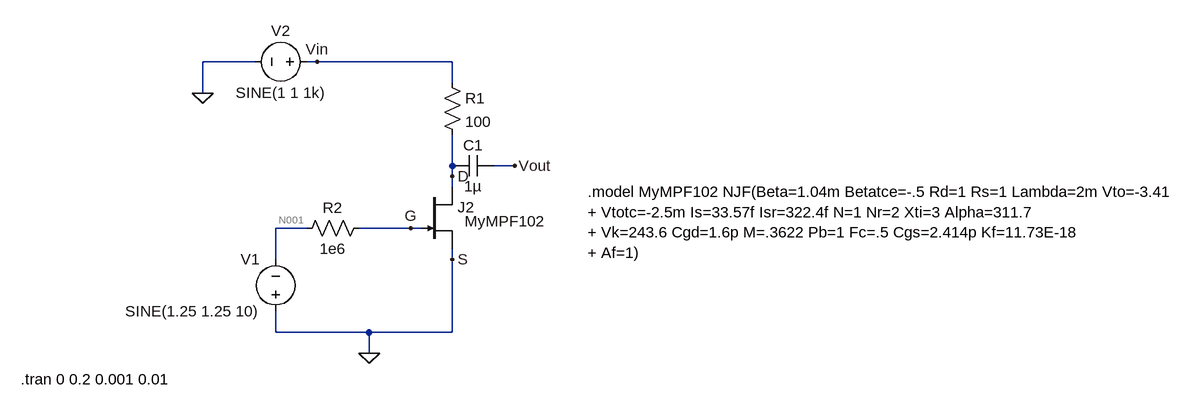
[diagram p0: schematic jfet_with_variable_gate_voltage.asc]
jfet_with_variable_gate_voltage.asc, the LTspice schematic file:
Version 4
SHEET 1 1424 680
WIRE -192 -96 -272 -96
WIRE -96 -96 -112 -96
WIRE 112 -96 -96 -96
WIRE 112 -64 112 -96
WIRE -272 -48 -272 -96
WIRE 112 64 112 16
WIRE 208 64 176 64
WIRE 112 80 112 64
WIRE 112 96 112 80
WIRE -112 160 -160 160
WIRE 48 160 -32 160
WIRE 64 160 48 160
WIRE -160 208 -160 160
WIRE 112 208 112 192
WIRE -160 320 -160 288
WIRE -16 320 -160 320
WIRE 112 320 112 208
WIRE 112 320 -16 320
WIRE -16 352 -16 320
FLAG 112 80 D
FLAG -16 352 0
FLAG -272 -48 0
FLAG 112 208 S
FLAG 48 160 G
FLAG -96 -96 Vin
FLAG 208 64 Vout
SYMBOL njf 64 96 R0
WINDOW 3 67 53 Left 2
SYMATTR Value MyMPF102
SYMATTR InstName J2
SYMBOL voltage -96 -96 R90
WINDOW 0 -32 56 VBottom 2
WINDOW 3 32 56 VTop 2
WINDOW 123 0 0 Left 0
WINDOW 39 0 0 Left 0
SYMATTR InstName V2
SYMATTR Value SINE(1 1 1k)
SYMBOL voltage -160 304 R180
WINDOW 0 24 96 Left 2
WINDOW 3 24 16 Left 2
WINDOW 123 0 0 Left 0
WINDOW 39 0 0 Left 0
SYMATTR InstName V1
SYMATTR Value SINE(1.25 1.25 10)
SYMBOL res 96 -80 R0
SYMATTR InstName R1
SYMATTR Value 100
SYMBOL cap 176 48 R90
WINDOW 0 0 32 VBottom 2
WINDOW 3 32 32 VTop 2
SYMATTR InstName C1
SYMATTR Value 1µ
SYMBOL res -16 144 R90
WINDOW 0 0 56 VBottom 2
WINDOW 3 32 56 VTop 2
SYMATTR InstName R2
SYMATTR Value 1e6
TEXT 320 104 Left 2 !.model MyMPF102 NJF(Beta=1.04m Betatce=-.5 Rd=1 Rs=1 Lambda=2m Vto=-3.41\n+ Vtotc=-2.5m Is=33.57f Isr=322.4f N=1 Nr=2 Xti=3 Alpha=311.7\n+ Vk=243.6 Cgd=1.6p M=.3622 Pb=1 Fc=.5 Cgs=2.414p Kf=11.73E-18\n+ Af=1)
TEXT -552 392 Left 2 !.tran 0 0.2 0.001 0.01

The netlist it stands for:
* jfet_with_variable_gate_voltage.asc
J2 D G 0 MyMPF102
V2 Vin 0 SINE(1 1 1k)
V1 0 N001 SINE(1.25 1.25 10)
R1 Vin D 100
C1 Vout D 1µ
R2 G N001 1e6
.model NJF NJF
.model PJF PJF
.lib standard.jft
.model MyMPF102 NJF(Beta=1.04m Betatce=-.5 Rd=1 Rs=1 Lambda=2m Vto=-3.41
+ Vtotc=-2.5m Is=33.57f Isr=322.4f N=1 Nr=2 Xti=3 Alpha=311.7
+ Vk=243.6 Cgd=1.6p M=.3622 Pb=1 Fc=.5 Cgs=2.414p Kf=11.73E-18
+ Af=1)
.tran 0 0.2 0.001 0.01
.backanno
.end

* Results of the author's LTspice run, read from the files saved beside the schematic
* Operating Point, zero values left out:
*   V(d) = 729.3 mV
*   V(g) = -1.25 V
*   V(vin) = 1 V
*   V(n001) = -1.25 V
*   V(vout) = 729.3 nV
*   Id(J2) = 2.707 mA
*   Ig(J2) = -4.208 pA
*   Is(J2) = -2.707 mA
*   I(R2) = 4.208 pA
*   I(R1) = 2.707 mA
*   I(V1) = -4.208 pA
*   I(V2) = -2.707 mA
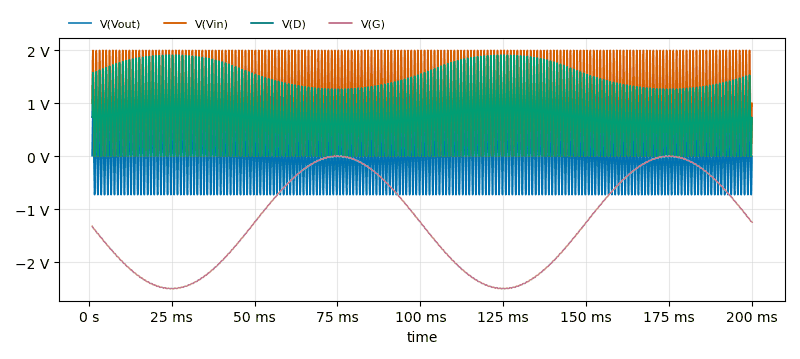
[diagram p1: Transient Analysis of jfet_with_variable_gate_voltage.asc, plotted from the saved traces]
* Transient Analysis, 1 run:
*   V(Vout): min -727.7 mV, max 1.181 V, average 41.1 mV, rms 576.6 mV, last -619.9 µV
*   V(Vin): min 27.12 µV, max 2 V, average 999.9 mV, rms 1.23 V, last 1 V
*   V(D): min 1.569 mV, max 1.91 V, average 770.4 mV, rms 961.4 mV, last 728.7 mV
*   V(G): min -2.505 V, max 5.235 mV, average -1.25 V, rms 1.532 V, last -1.245 V